# Altium schematic sheet LV_connector.SchDoc
size Letter; DrawnBy: Robson Souza; SheetNumber: 8; SheetTotal: 9
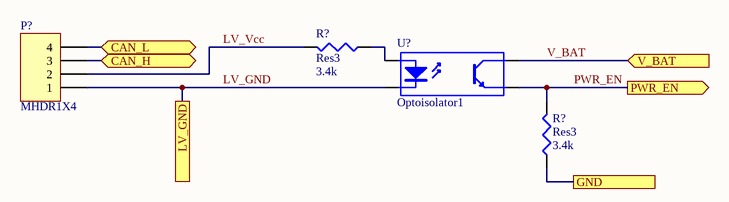
[diagram p0: LV_connector.SchDoc]

## Parts
(Parts that share a designator on the sheet are numbered #1, #2 ... from top to bottom, then left to right.)
P?  MHDR1X4  [MHDR1X4]
R?#1  Res3  value 3.4k  [J1-0603]
R?#2  Res3  value 3.4k  [J1-0603]
U?  Optoisolator1  [DIP-4]

## Ports
CAN_H (bidir), CAN_L (bidir), GND, LV_GND, PWR_EN (out), V_BAT (in)

## Nets
CAN_H: P?.3 ; port CAN_H
CAN_L: P?.4 ; port CAN_L
GND: R?#2.1 ; port GND
LV_GND: P?.1 U?.2(K) ; port LV_GND
LV_Vcc: P?.2 R?#1.2
PWR_EN: R?#2.2 U?.3(E) ; port PWR_EN
V_BAT: U?.4(C) ; port V_BAT
NetR?#1_1: R?#1.1 U?.1(A)

## Library data of the parts
P? = MHDR1X4: Header, 4-Pin; LatestRevisionDate: 17-Jul-2002; LatestRevisionNote: Re-released for DXP Platform.; Publisher: Altium Limited
R?#1 R?#2 = Res3: Resistor; Published: 8-Jun-2000; LatestRevisionDate: 29-May-2009; LatestRevisionNote: IPC-7351 Footprint Added.; PackageReference: J1-0603; Publisher: Altium Limited; PackageDescription: Chip Resistor
U? = Optoisolator1: 4-Pin Phototransistor Optocoupler; Published: 24-Mar-1999; LatestRevisionDate: 04-Mar-2005; LatestRevisionNote: Sch pins 3 & 4 Swapped.; DatasheetVersion: Nov-2003; PackageReference: DIP-4; Publisher: Altium Limited